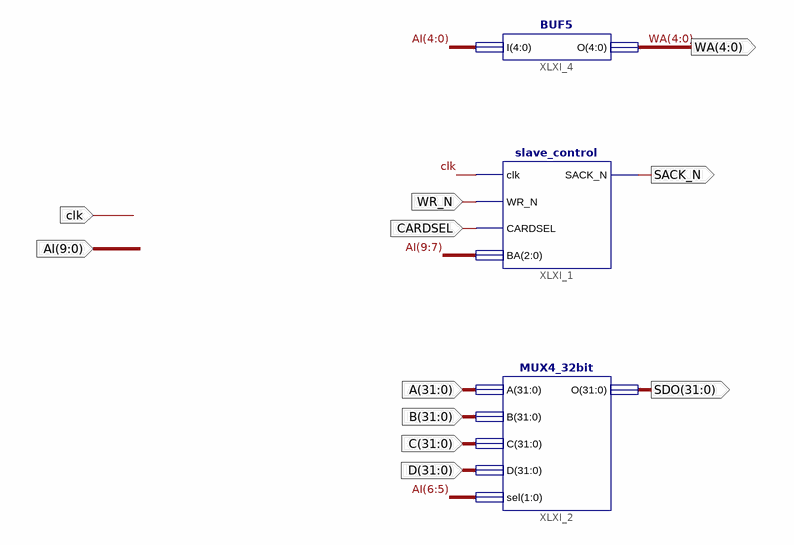
[diagram p0: schematic sheet 1]
// Xilinx ISE schematic monitor_slave.sch (spartan6) as structural Verilog: 3 symbols, 11 ports
module monitor_slave (
  input  clk,
  input  [31:0] A,
  input  [31:0] B,
  input  [31:0] C,
  input  [31:0] D,
  input  WR_N,
  input  CARDSEL,
  input  [9:0] AI,
  output SACK_N,
  output [31:0] SDO,
  output [4:0] WA
);

  slave_control XLXI_1 (.clk(clk), .WR_N(WR_N), .CARDSEL(CARDSEL), .BA(AI[9:7]), .SACK_N(SACK_N));
  MUX4_32bit XLXI_2 (.A(A), .B(B), .C(C), .D(D), .sel(AI[6:5]), .O(SDO));
  BUF5 XLXI_4 (.I(AI[4:0]), .O(WA));
endmodule
